# Altium schematic sheet Mother_board_sauvc_2025.SchDoc
size A4; SheetNumber: 1; SheetTotal: 5
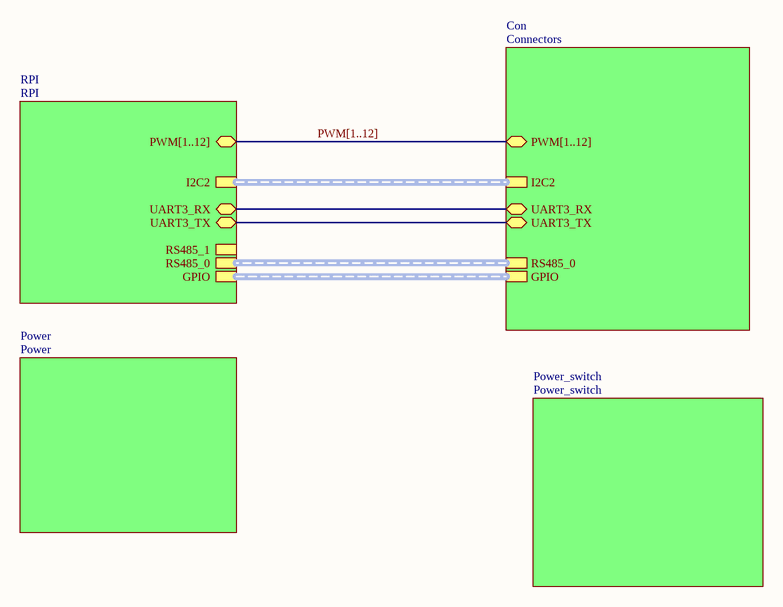
[diagram p0: Mother_board_sauvc_2025.SchDoc]

## Sub-sheets
Con = Connectors: PWM[1..12] (bidir), I2C2 (harness *), UART3_RX (bidir), UART3_TX (bidir), GPIO (harness GPIO), RS485_0 (harness RS485_0)
Power = Power: no entries
Power_switch = Power_switch: no entries
RPI = RPI: PWM[1..12] (bidir), I2C2 (harness *), UART3_RX (bidir), UART3_TX (bidir), RS485_1 (harness RS485_1), RS485_0 (harness RS485_0), GPIO (harness GPIO)

## Nets
(unnamed): sheet RPI/UART3_RX, sheet Con/UART3_RX
(unnamed): sheet RPI/UART3_TX, sheet Con/UART3_TX

## Buses and harness runs
bus PWM[1..12] = sheet Con/PWM[1..12] = sheet RPI/PWM[1..12]
harness sheet Con/GPIO = sheet RPI/GPIO
harness sheet Con/I2C2 = sheet RPI/I2C2
harness sheet Con/RS485_0 = sheet RPI/RS485_0